# Altium schematic sheet RS232.SchDoc
size 420 x 297 mm; PageSetup: Record=PageOptions|CenterHorizontal=True|CenterVertical=True|PrintScale=0.94|XCorrection=1.00|YCorrection=1.00|PrintKind=1|BorderSize=5000000|LeftOffset=0|BottomOffset=0|Orientation=1|PaperLength=2970|PaperWidth=2100|Scale=100|PaperSource=7|PrintQuality=600|MediaType=1|DitherType=10|PaperKind=A4|PrintScaleMode=1; AllNome: AllNome; Izm: -; TYAS: ТУАС.000-00; List: Нов.; Address1: Address1; Address2: Address2; Address3: Address3; Address4: Address4; SheetNumber: 1; Scale: 1:1; Обозначение документа: АБВГ.123456.001 Э3
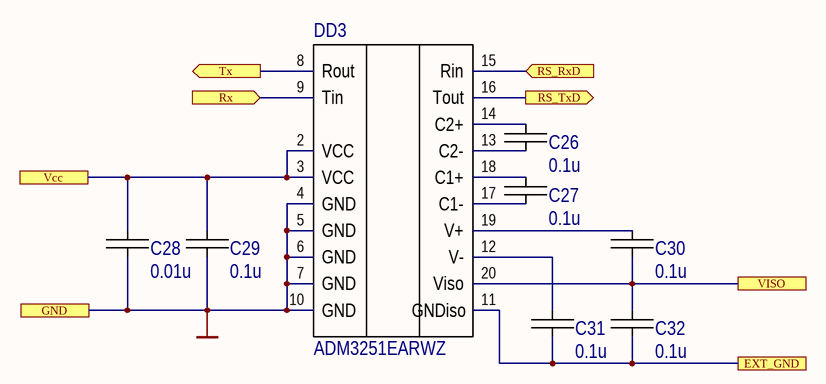
[diagram p0: RS232.SchDoc]

## Parts
C26  0.1u  [C0603_IPC]
C27  0.1u  [C0603_IPC]
C28  0.01u  [C0603_IPC]
C29  0.1u  [C0603_IPC]
C30  0.1u  [C0603_IPC]
C31  0.1u  [C0603_IPC]
C32  0.1u  [C0603_IPC]
DD3  ADM3251EARWZ  [SOIC20W]

## Ports
EXT_GND, GND, RS_RxD (in), RS_TxD (out), Rx (in), Tx (out), Vcc, VISO

## Nets
GND: C28.2 C29.1 DD3.4(GND) DD3.5(GND) DD3.6(GND) DD3.7(GND) DD3.10(GND) ; port GND
EXT_GND: C31.1 C32.1 DD3.11(GNDiso) ; port EXT_GND
RS_RxD: DD3.15(Rin) ; port RS_RxD
RS_TxD: DD3.16(Tout) ; port RS_TxD
Rx: DD3.9(Tin) ; port Rx
Tx: DD3.8(Rout) ; port Tx
Vcc: C28.1 C29.2 DD3.2(NC) DD3.3(VCC) ; port Vcc
VISO: C30.1 C32.2 DD3.20(Viso) ; port VISO
NetC26_1: C26.1 DD3.13(C2-)
NetC26_2: C26.2 DD3.14(C2+)
NetC27_1: C27.1 DD3.17(C1-)
NetC27_2: C27.2 DD3.18(C1+)
NetC30_2: C30.2 DD3.19(V+)
NetC31_2: C31.2 DD3.12(V-)

Not connected (* = marked no-connect by the designer): DD3 1(NC)

## Notes on the sheet
- Подп. и дата
- Инв. № дубл.
- Взам. инв. №
- Инв. № подл.
- Изм.
- Лист
- № докум.
- Подп.
- Дата
- Копировал
- Формат А3

## Library data of the parts
C26 C27 C29-C32 = 0.1u 50V: 0.1uF ±10% 50V Ceramic Capacitor X7R 0603 (1608 Metric); MPN: CL10B104KB8NNND; Manufacturer: Samsung; Tolerance: 0,1; PartNumber: 0.1u 50V; Value: 0.1u; Voltage/Power: 50V; LibraryPath: _library\sch\cap.schlib; FootprintPath: _library\pcb\capSmd.pcblib; ComponentLink2URL: https://www.digikey.com/product-detail/en/yageo/CC0603KRX7R9BB104/311-1344-2-ND/2103082; ComponentLink2Description: site; Type: X7R; price elitan 1000pc: 0.63; price terra 1000pc: 0.65
C28 = 0.01u 50V: 0.01uF ±10% 50V Ceramic Capacitor X7R 0603 (1608 Metric); MPN: CC0603KRX7R9BB103; Manufacturer: Yageo; Tolerance: 0,1; Name: 0.01u 50V; Value: 0.01u; Voltage/Power: 50V; LibraryPath: _library\sch\cap.schlib; FootprintPath: _library\pcb\capSmd.pcblib; ComponentLink2URL: https://www.digikey.com/product-detail/en/yageo/CC0603KRX7R9BB103/311-1085-2-ND/302819; ComponentLink2Description: site; Type: X7R; price elitan 1000pc: 0.54; price terra 1000pc: 0.62
DD3 = ADM3251E: Isolated, Single-Channel RS-232 Line Driver/Receiver; Component Package: SOIC, 20-Leads, Body 12,80x7,50mm, Pitch 1,27mm, IPC Medium Density; Component Name: ADM3251EARWZ; HelpURL: C:\DATASHEET\Driver\ADM3251E.pdf; ComponentLink1Description: DataSheet; ComponentLink1URL: C:\DATASHEET\Driver\ADM3251E.pdf; Name: ADM3251E; MPN: ADM3251EARWZ; ComponentLink2URL: https://www.analog.com/media/en/technical-documentation/data-sheets/ADM3251E.pdf; ComponentLink2Description: site; LibraryPath: _library\sch; FootprintPath: _library\pcb; ComponentLink3URL: http://pulsarnpp.ru/index.php/2-uncategorised/236-seriya-1432nov; ComponentLink3Description: 1432УД8; ComponentLink4URL: http://www.ti.com/product/opa694/description; ComponentLink4Description: OPA658